# EasyEDA Pro project 一体板.epro, board PCB2
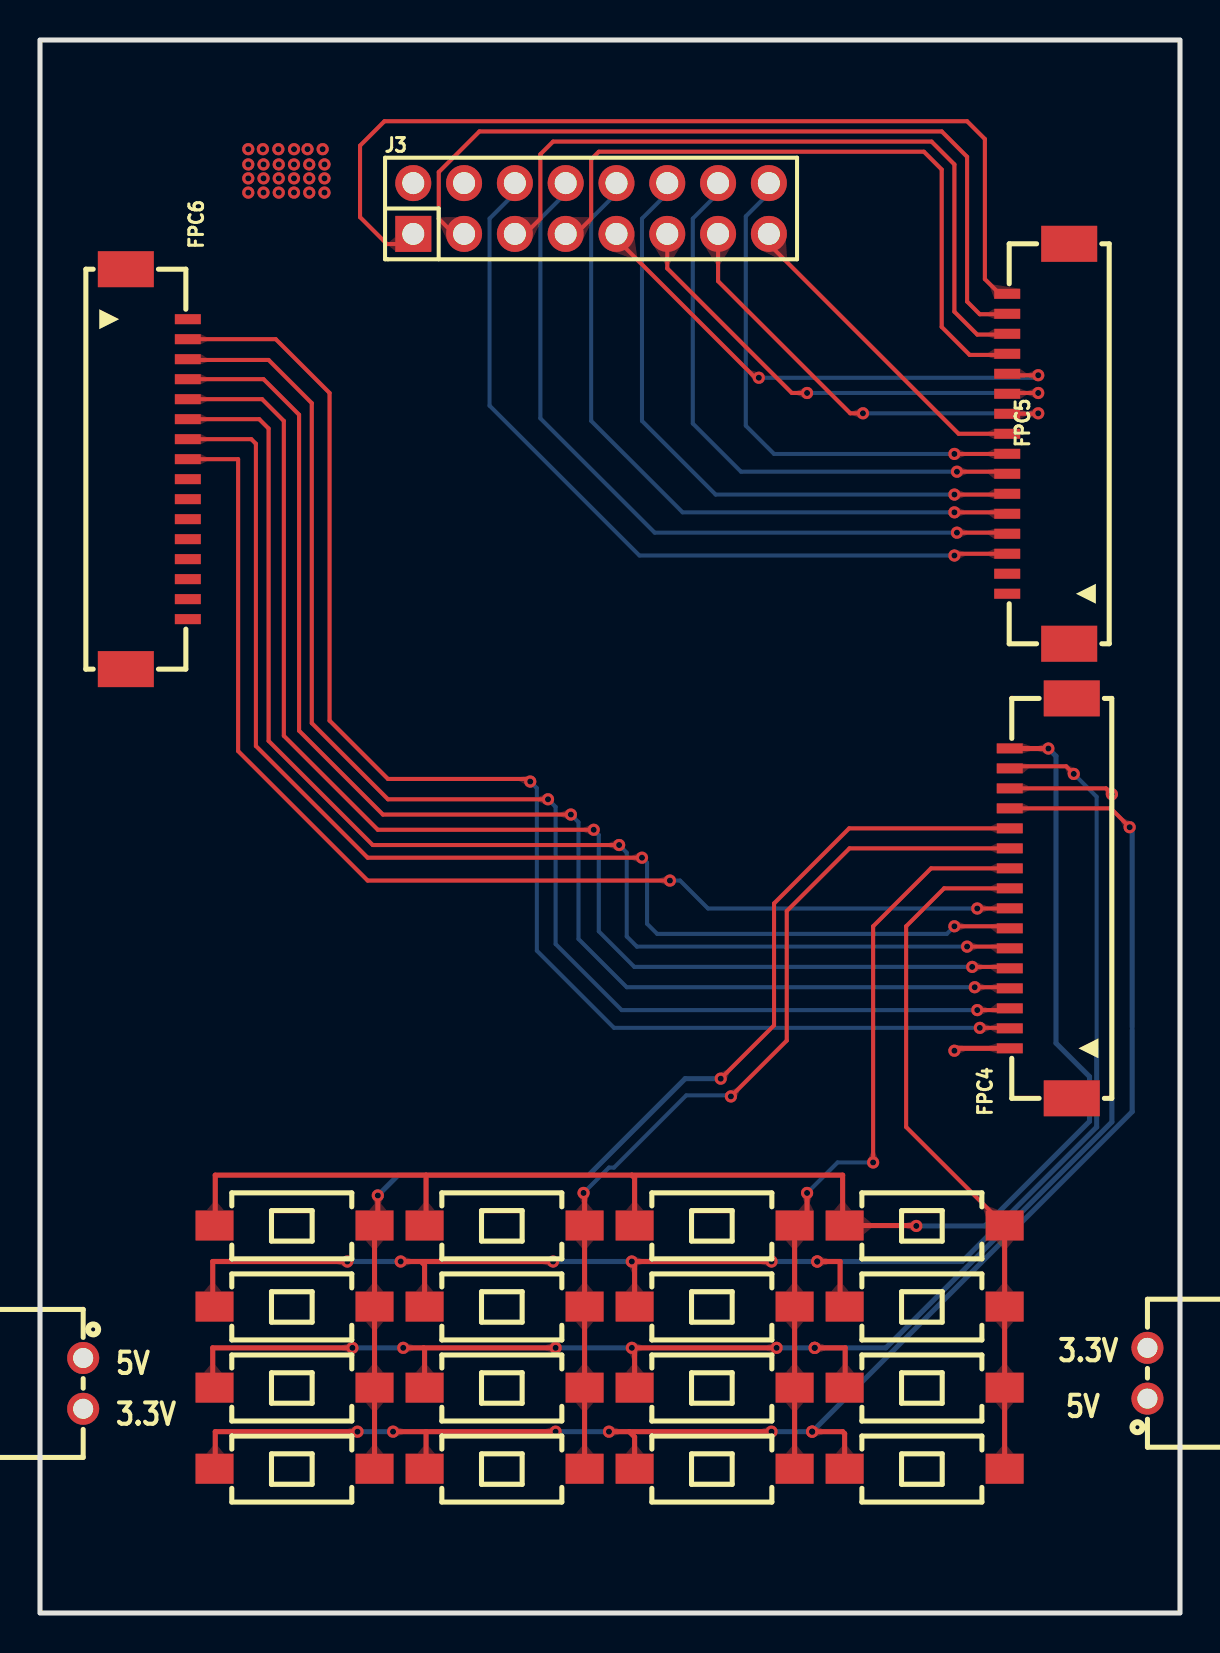
[diagram p15: board, top side]
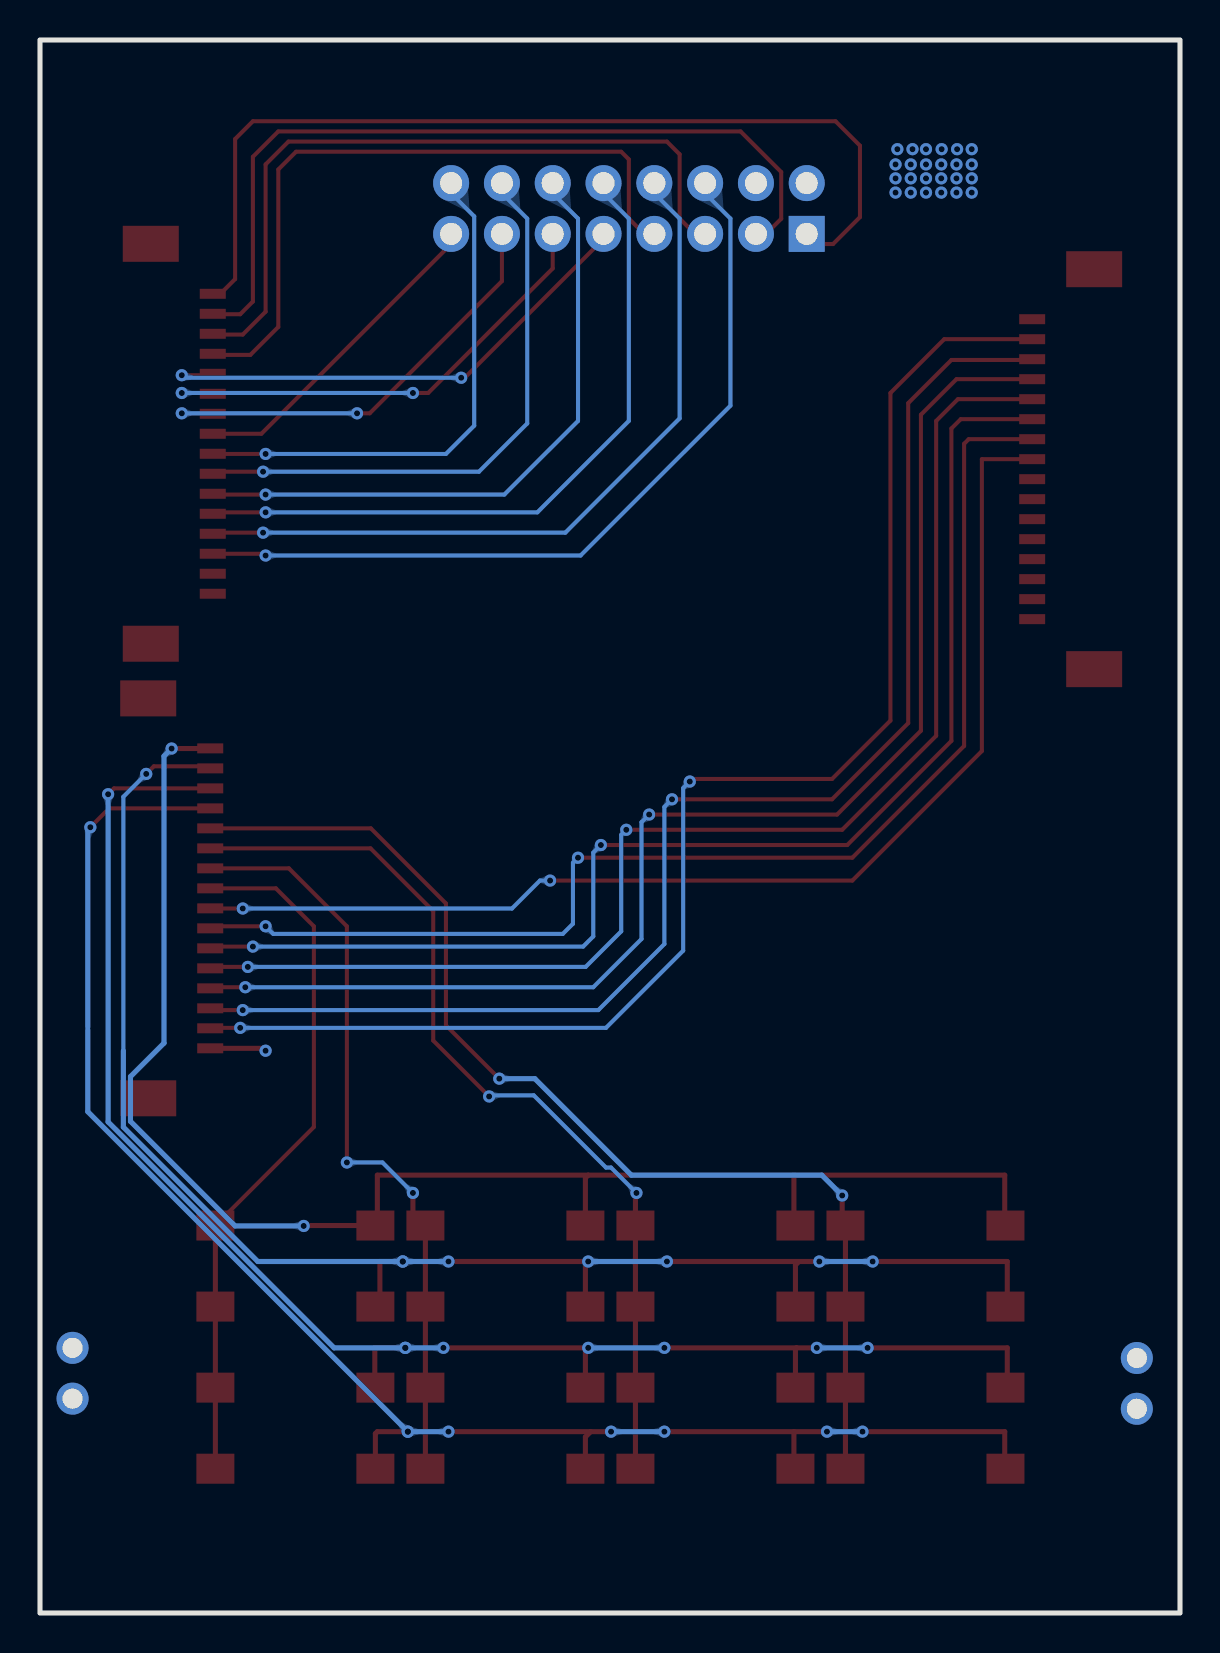
[diagram p16: board, bottom side, seen from below]

Outline 57 x 78.67 mm; copper layers: Top Layer, Inner1, Inner2, Bottom Layer. Coordinates in mm from the lower left corner of the outline.
Outline path: rectangle 0,78.67 57,0
Stack: Top Layer 0.035mm / Dielectric1 0.48mm PP er 4.5 / Inner1 0.035mm / Dielectric2 0.48mm FR4 er 4.5 / Inner2 0.035mm / Dielectric3 0.48mm PP er 4.5 / Bottom Layer 0.035mm

## Design rules (mm)
template: JLCPCB Capability(Two Layers Board)
spacing copperThickness1oz (default): track to track 0.102, other pairs 0.152 to 0.3
spacing copperThickness2oz: track to track 0.203, other pairs 0.152 to 0.3
track width copperThickness1oz (default): min 0.127, default 0.254, max 2.54
track width copperThickness2oz: min 0.203, default 0.254, max 2.54
differential pair differentialPair (default): width min 0.127, default 0.254, max 2.54; gap min 0.152, default 0.152
via viaSize (default): diameter min 0.5, default 0.61, max 10; hole min 0.3, default 0.305, max 6.3

## Placement (name value [footprint] x y rotation side)
CN17  XH-2AW  [CONN-TH_XH-2AW_C2908611]  2.16 11.48 270 top
CN18  XH-2AW  [CONN-TH_XH-2AW_C2908611]  55.37 11.99 90 top
FPC4  F1004-H-16-20G-R  [CONN-SMD_F1004-H-16-20G-R]  50.04 35.74 90 top
FPC5  F1004-H-16-20G-R  [CONN-SMD_F1004-H-16-20G-R]  49.91 58.47 90 top
FPC6  F1004-H-16-20G-R  [CONN-SMD_F1004-H-16-20G-R]  5.84 57.2 270 top
J3  2.54-2*8P母  [HDR-TH_16P-P2.54-V-F-R2-C8-S2.54-1]  27.55 70.24 0 top
SW1  TS-1101-C-W  [SW-SMD_L6.0-W3.3-LS8.0]  12.73 19.38 0 top
SW2  TS-1101-C-W  [SW-SMD_L6.0-W3.3-LS8.0]  12.73 15.32 0 top
SW3  TS-1101-C-W  [SW-SMD_L6.0-W3.3-LS8.0]  12.73 11.27 0 top
SW4  TS-1101-C-W  [SW-SMD_L6.0-W3.3-LS8.0]  12.73 7.22 0 top
SW5  TS-1101-C-W  [SW-SMD_L6.0-W3.3-LS8.0]  23.23 19.38 0 top
SW6  TS-1101-C-W  [SW-SMD_L6.0-W3.3-LS8.0]  23.23 15.32 0 top
SW7  TS-1101-C-W  [SW-SMD_L6.0-W3.3-LS8.0]  23.23 11.27 0 top
SW8  TS-1101-C-W  [SW-SMD_L6.0-W3.3-LS8.0]  23.23 7.22 0 top
SW9  TS-1101-C-W  [SW-SMD_L6.0-W3.3-LS8.0]  33.73 19.38 0 top
SW10  TS-1101-C-W  [SW-SMD_L6.0-W3.3-LS8.0]  33.73 15.32 0 top
SW11  TS-1101-C-W  [SW-SMD_L6.0-W3.3-LS8.0]  33.73 11.27 0 top
SW12  TS-1101-C-W  [SW-SMD_L6.0-W3.3-LS8.0]  33.73 7.22 0 top
SW13  TS-1101-C-W  [SW-SMD_L6.0-W3.3-LS8.0]  44.23 19.38 0 top
SW14  TS-1101-C-W  [SW-SMD_L6.0-W3.3-LS8.0]  44.23 15.32 0 top
SW15  TS-1101-C-W  [SW-SMD_L6.0-W3.3-LS8.0]  44.23 11.27 0 top
SW16  TS-1101-C-W  [SW-SMD_L6.0-W3.3-LS8.0]  44.23 7.22 0 top

## Footprints (pads in the part's own frame, mm; a bottom-side part is the same pattern mirrored in y, then rotated)
CONN-SMD_F1004-H-16-20G-R
  rect 0.5x1.3 smd: 1(-7.5,1.55) 2(-6.5,1.55) 3(-5.5,1.55) 4(-4.5,1.55) 5(-3.5,1.55) 6(-2.5,1.55) 7(-1.5,1.55) 8(-0.5,1.55) 9(0.5,1.55) 10(1.5,1.55) 11(2.5,1.55) 12(3.5,1.55) 13(4.5,1.55) 14(5.5,1.55) 15(6.5,1.55) 16(7.5,1.55)
  rect 1.8x2.8 smd: 17(10,-1.55) 18(-10,-1.55)
CONN-TH_XH-2AW_C2908611
  round 1.6 hole 1: 1(-1.27,0) 2(1.27,0)
HDR-TH_16P-P2.54-V-F-R2-C8-S2.54-1
  rect 1.8x1.8 hole 1.1: 1(-8.89,-1.27)
  round 1.8 hole 1.1: 2(-8.89,1.27) 3(-6.35,-1.27) 4(-6.35,1.27) 5(-3.81,-1.27) 6(-3.81,1.27) 7(-1.27,-1.27) 8(-1.27,1.27) 9(1.27,-1.27) 10(1.27,1.27) 11(3.81,-1.27) 12(3.81,1.27) 13(6.35,-1.27) 14(6.35,1.27) 15(8.89,-1.27) 16(8.89,1.27)
SW-SMD_L6.0-W3.3-LS8.0
  rect 1.9x1.5 smd: 1(-4,0) 2(4,0)

## Nets
As in the schematic.

Pads without a net: FPC4 17 18; FPC5 17 18; FPC6 1 9 10 11 12 13 14 15 16 17 18

## Via types
v1: diameter 0.61, hole 0.305, Top Layer to Bottom Layer, 83 vias

## Routing (per net, layer and track width the routed paths; a pad name or vN(x,y) marks a point on that pad's centre or on a via; arc(x,y) is an arc through that point)
3.3V_LDO: length 132.4
  Inner1 w0.381: 21.2,71.51 19.25,73.46 16.89,73.46 15.49,72.06 15.49,67.49 16.26,66.73 20.45,66.73 22.67,64.51 22.67,30.72 7.06,15.11
  Inner1 w2: CN18.2 53.52,15.11 6.3,15.11 5.84,14.66 5.84,13.39 2.54,10.09
5V_DCDC: length 53.8
  Inner2 w2: 2.41,12.75 6.1,12.75 8.13,10.72 55.37,10.72
GND: length 2.8
  Top Layer w0.254: v1(45.72,28.12) 45.84,28.24 FPC4.1
  vias: v1(10.41,73.2) v1(10.41,72.44) v1(10.41,71.75) v1(10.41,71.03) v1(11.14,73.2) v1(11.18,72.44) v1(11.18,71.75) v1(11.18,71.03) v1(11.92,73.2) v1(11.94,72.44) v1(11.94,71.75) v1(11.94,71.03) v1(12.7,73.2) v1(12.7,72.44) v1(12.7,71.75) v1(12.7,71.03) v1(13.38,73.2) v1(13.46,72.44) v1(13.46,71.75) v1(13.46,71.03) v1(14.13,73.2) v1(14.22,72.44) v1(14.22,71.75) v1(14.22,71.03)
A2: length 64.9
  Top Layer w0.203: FPC6.5 11.1,60.7 12.19,59.62 12.19,43.87 16.89,39.17 v1(27.69,39.17) ; FPC4.5 48.42,32.31 v1(46.61,32.31)
  Bottom Layer w0.203: v1(46.61,32.31) 29.72,32.31 27.94,34.09 27.94,38.91 v1(27.69,39.17)
A3: length 66.4
  Top Layer w0.203: v1(46.74,31.29) 48.43,31.29 FPC4.4 ; v1(26.54,39.93) 17.15,39.93 12.95,44.12 12.95,59.92 11.18,61.7 FPC6.4
  Bottom Layer w0.203: v1(46.74,31.29) 29.34,31.29 26.92,33.71 26.92,39.55 v1(26.54,39.93)
A4: length 68
  Top Layer w0.203: v1(46.86,30.15) 48.4,30.15 FPC4.3 ; v1(25.4,40.69) 17.4,40.69 13.59,44.5 13.59,60.5 11.43,62.66 7.43,62.66 FPC6.3
  Bottom Layer w0.203: v1(46.86,30.15) 29.08,30.15 25.78,33.45 25.78,40.31 v1(25.4,40.69)
A5: length 69.7
  Top Layer w0.203: FPC6.2 11.79,63.7 14.48,61.01 14.48,44.63 17.4,41.71 24.5,41.71 ; FPC4.2 48.47,29.26 v1(46.99,29.26)
  Bottom Layer w0.203: v1(46.99,29.26) 28.7,29.26 24.84,33.12 24.84,41.25 v1(24.51,41.58)
BL_IPS: length 25.8
  Top Layer w0.203: FPC5.8 48.35,57.96 v1(45.72,57.96)
  Bottom Layer w0.203: 36.44,71 35.29,69.85 35.29,59.38 36.7,57.96 v1(45.72,57.96)
CS_IPS: length 28.8
  Top Layer w0.203: FPC5.7 48.26,57.08 v1(45.85,57.08)
  Bottom Layer w0.203: 33.9,71 32.64,69.74 32.64,59.49 35.05,57.08 v1(45.85,57.08)
D0_IPS: length 47.3
  Top Layer w0.203: FPC5.16 47.98,65.97 47.24,66.71 47.24,73.71 46.35,74.6 17.22,74.6 16,73.38 16,69.81 17.35,68.46 18.66,68.46
D1_IPS: length 41.4
  Top Layer w0.203: FPC5.15 48.34,64.95 46.99,64.95 46.35,65.58 46.35,72.82 45.09,74.09 21.97,74.09 19.94,72.06 19.94,69.73 21.2,68.46
D2_IPS: length 37
  Top Layer w0.203: FPC5.14 48.32,63.93 46.86,63.93 45.72,65.08 45.72,72.44 44.58,73.59 25.65,73.59 25.02,72.95 25.02,69.74 23.74,68.46
D3_IPS: length 34.6
  Top Layer w0.203: FPC5.13 48.31,62.92 46.48,62.92 45.09,64.31 45.09,72.19 44.2,73.08 27.94,73.08 27.56,72.7 27.56,69.74 26.28,68.46
D4_IPS: length 25.5
  Top Layer w0.203: v1(49.91,61.9) 48.43,61.9 FPC5.12 ; 28.82,68.46 29.08,68.46 35.76,61.77 v1(35.94,61.77)
  Bottom Layer w0.203: v1(35.94,61.77) 49.78,61.77 v1(49.91,61.9)
D5_IPS: length 23.9
  Top Layer w0.203: v1(38.35,61.01) 37.59,61.01 31.36,67.24 31.36,68.46 ; v1(49.91,61.01) 48.4,61.01 FPC5.11
  Bottom Layer w0.203: v1(38.35,61.01) v1(49.91,61.01)
D6_IPS: length 22.2
  Top Layer w0.203: 33.9,68.46 33.9,66.61 40.51,60 v1(41.15,60) ; FPC5.10 49.89,59.97 v1(49.91,60)
  Bottom Layer w0.203: v1(41.15,60) v1(49.91,60)
D7_IPS: length 15.8
  Top Layer w0.203: 36.44,68.46 45.93,58.97 FPC5.9
DIR_BRUSHED_MOTOR: length 59
  Top Layer w0.203: FPC4.8 48.48,35.23 v1(46.86,35.23) ; FPC6.8 9.91,57.7 9.91,43.11 16.38,36.63 v1(31.5,36.63)
  Bottom Layer w0.203: v1(31.5,36.63) 32,36.63 33.4,35.23 v1(46.86,35.23)
KEY_1: length 77.1
  Top Layer w0.254: 29.59,21.9 19.3,21.9 ; 29.59,21.9 29.73,21.76 SW9.1 ; 29.59,21.9 40.13,21.9 40.13,19.48 SW13.1 43.79,19.38 v1(43.81,19.36) ; 19.3,21.9 19.3,19.45 SW5.1 ; 19.3,21.9 8.76,21.9 8.76,19.74 ; FPC4.16 48.5,43.23 v1(50.42,43.23)
  Bottom Layer w0.254: v1(50.42,43.23) 50.8,42.85 50.8,28.5 52.48,26.82 52.48,24.59 47.24,19.36 v1(43.81,19.36)
KEY_2: length 78.9
  Top Layer w0.203: FPC4.15 48.59,42.34 51.31,42.34 v1(51.69,41.96)
  Top Layer w0.254: v1(15.37,17.58) 8.64,17.58 8.64,15.29 ; SW14.1 40,15.55 40,17.58 v1(38.86,17.58) ; v1(25.65,17.58) 19.05,17.58 ; 19.05,17.58 19.23,17.4 SW6.1 ; 19.05,17.58 v1(18.03,17.58) ; SW10.1 29.73,17.44 v1(29.59,17.58) v1(36.58,17.58)
  Bottom Layer w0.203: 52.83,28.12 52.83,40.82 v1(51.69,41.96)
  Bottom Layer w0.254: v1(29.59,17.58) v1(25.65,17.58) ; v1(36.58,17.58) v1(38.86,17.58) 46.11,17.58 52.83,24.3 52.83,28.12 ; v1(18.03,17.58) v1(15.37,17.58)
KEY_3: length 80.7
  Top Layer w0.203: FPC4.14 53.3,41.24 v1(53.59,40.95)
  Top Layer w0.254: 19.18,13.26 19.23,13.21 SW7.1 ; 19.18,13.26 v1(18.16,13.26) ; 19.18,13.26 v1(25.78,13.26) ; SW11.1 29.73,13.12 v1(29.59,13.26) v1(36.83,13.26) ; SW15.1 40.26,11.3 40.26,13.26 v1(38.74,13.26) ; v1(15.62,13.26) 8.64,13.26 8.64,11.36
  Bottom Layer w0.254: v1(53.59,40.95) 53.59,24.56 42.3,13.26 v1(38.74,13.26) v1(36.83,13.26) ; v1(29.59,13.26) v1(25.78,13.26) ; v1(18.16,13.26) v1(15.62,13.26)
KEY_4: length 81.9
  Top Layer w0.203: FPC4.13 53.54,40.24 v1(54.48,39.3)
  Top Layer w0.254: 29.46,9.07 29.73,8.8 SW12.1 ; 29.46,9.07 v1(28.45,9.07) ; 29.46,9.07 v1(36.58,9.07) ; 19.3,9.07 19.3,7.29 SW8.1 ; 19.3,9.07 v1(25.78,9.07) ; 19.3,9.07 v1(17.65,9.07) ; v1(38.61,9.07) 40.13,9.07 40.23,8.97 SW16.1 ; 8.76,7.42 8.76,9.07 v1(15.88,9.07)
  Bottom Layer w0.254: v1(36.58,9.07) v1(38.61,9.07) 54.61,25.07 54.61,29.16 ; v1(54.48,39.3) 54.61,39.17 54.61,29.29 ; v1(28.45,9.07) v1(25.78,9.07) ; v1(17.65,9.07) v1(15.88,9.07)
KEY_5: length 56.2
  Top Layer w0.203: v1(34.04,26.72) 36.7,29.39 36.7,35.49 40.46,39.24 FPC4.12
  Top Layer w0.254: 16.64,7.42 16.73,7.51 SW3.2 SW2.2 SW1.2 16.89,19.54 v1(16.89,20.88)
  Bottom Layer w0.254: v1(16.89,20.88) 17.91,21.9 27.43,21.9 32.26,26.72 33.91,26.72
KEY_6: length 46.4
  Top Layer w0.203: FPC4.11 40.47,38.24 37.34,35.1 37.34,28.63 v1(34.54,25.83)
  Top Layer w0.254: 27.56,7.04 27.23,7.37 SW7.2 SW6.2 SW5.2 27.23,20.96 v1(27.18,21.01)
  Bottom Layer w0.203: v1(27.18,21.01) 28.45,22.28 28.7,22.28 32.31,25.89 34.49,25.89 v1(34.54,25.83)
KEY_7: length 37.7
  Top Layer w0.203: v1(41.66,22.53) 41.66,34.34 44.55,37.24 FPC4.10
  Top Layer w0.254: v1(38.35,21.01) 38.35,20 SW9.2 SW10.2 SW11.2 37.73,7.68 37.47,7.42
  Bottom Layer w0.203: v1(38.35,21.01) 39.88,22.53 v1(41.66,22.53)
KEY_8: length 35.5
  Top Layer w0.203: FPC4.9 45.2,36.24 43.31,34.34 43.31,24.3 SW13.2
  Top Layer w0.254: SW13.2 SW14.2 SW15.2 48.23,7.45 48.64,7.04
PWM_BRUSHED_MOTOR: length 62.2
  Top Layer w0.203: v1(30.1,37.77) 16.38,37.77 10.79,43.36 10.79,58.47 10.56,58.7 FPC6.7 ; FPC4.7 48.38,34.34 v1(45.72,34.34)
  Bottom Layer w0.203: v1(45.72,34.34) 45.34,33.96 30.86,33.96 30.35,34.47 30.35,37.52 v1(30.1,37.77)
RDV_IPS: length 40.2
  Top Layer w0.203: FPC5.3 45.81,52.97 v1(45.72,52.88)
  Bottom Layer w0.203: v1(45.72,52.88) 29.97,52.88 22.48,60.38 22.48,69.74 23.74,71
RS_IPS: length 34.6
  Top Layer w0.203: FPC5.5 48.29,55.04 v1(45.72,55.04)
  Bottom Layer w0.203: 28.82,71 27.56,69.74 27.56,59.62 32.13,55.04 v1(45.72,55.04)
RST_IPS: length 31.7
  Top Layer w0.203: v1(45.72,55.93) 48.32,55.93 FPC5.6
  Bottom Layer w0.203: 31.36,71 30.1,69.74 30.1,59.62 33.78,55.93 v1(45.72,55.93)
STEERING_1: length 63.7
  Top Layer w0.203: FPC6.6 10.96,59.7 11.43,59.23 11.43,43.61 16.64,38.41 v1(28.96,38.41) ; v1(46.35,33.33) 48.4,33.33 FPC4.6
  Bottom Layer w0.203: v1(46.35,33.33) 29.84,33.33 29.34,33.83 29.34,38.03 v1(28.96,38.41)
WR_IPS: length 37.5
  Top Layer w0.203: FPC5.4 48.31,54.03 v1(45.85,54.03)
  Bottom Layer w0.203: 26.28,71 25.02,69.74 25.02,59.74 30.73,54.03 v1(45.85,54.03)

## Copper pours and planes (outline as drawn; the poured copper is in the pictures)
GND on Top Layer: -270.83,-23.82 -270.83,69.01 -144.72,69.01 -144.72,-23.82
GND on Bottom Layer: -160.78,157.66 -86.36,157.66 -86.36,31.55 -160.78,31.55
GND on Inner1: 260.48,-83.32 167.64,-83.32 167.64,42.79 260.48,42.79
GND on Inner2: -126.3,-95.71 -126.3,-2.87 -0.19,-2.87 -0.19,-95.71

Small or netless copper shapes (teardrops, artwork), in the pictures only: 151 on Top Layer, 70 on Bottom Layer, 1 on Inner1

## Text on the board
Top Solder Mask Layer: 西南交通大学 / 听党指挥，独轮不倒 / 丁卓 陈建希 姚锦涛
Top Silkscreen Layer: 5V | 3.3V
